# Altium schematic sheet [10] - ESP32.SchDoc
size A4; DocumentNumber: 10; SheetNumber: 10; SheetTotal: 14
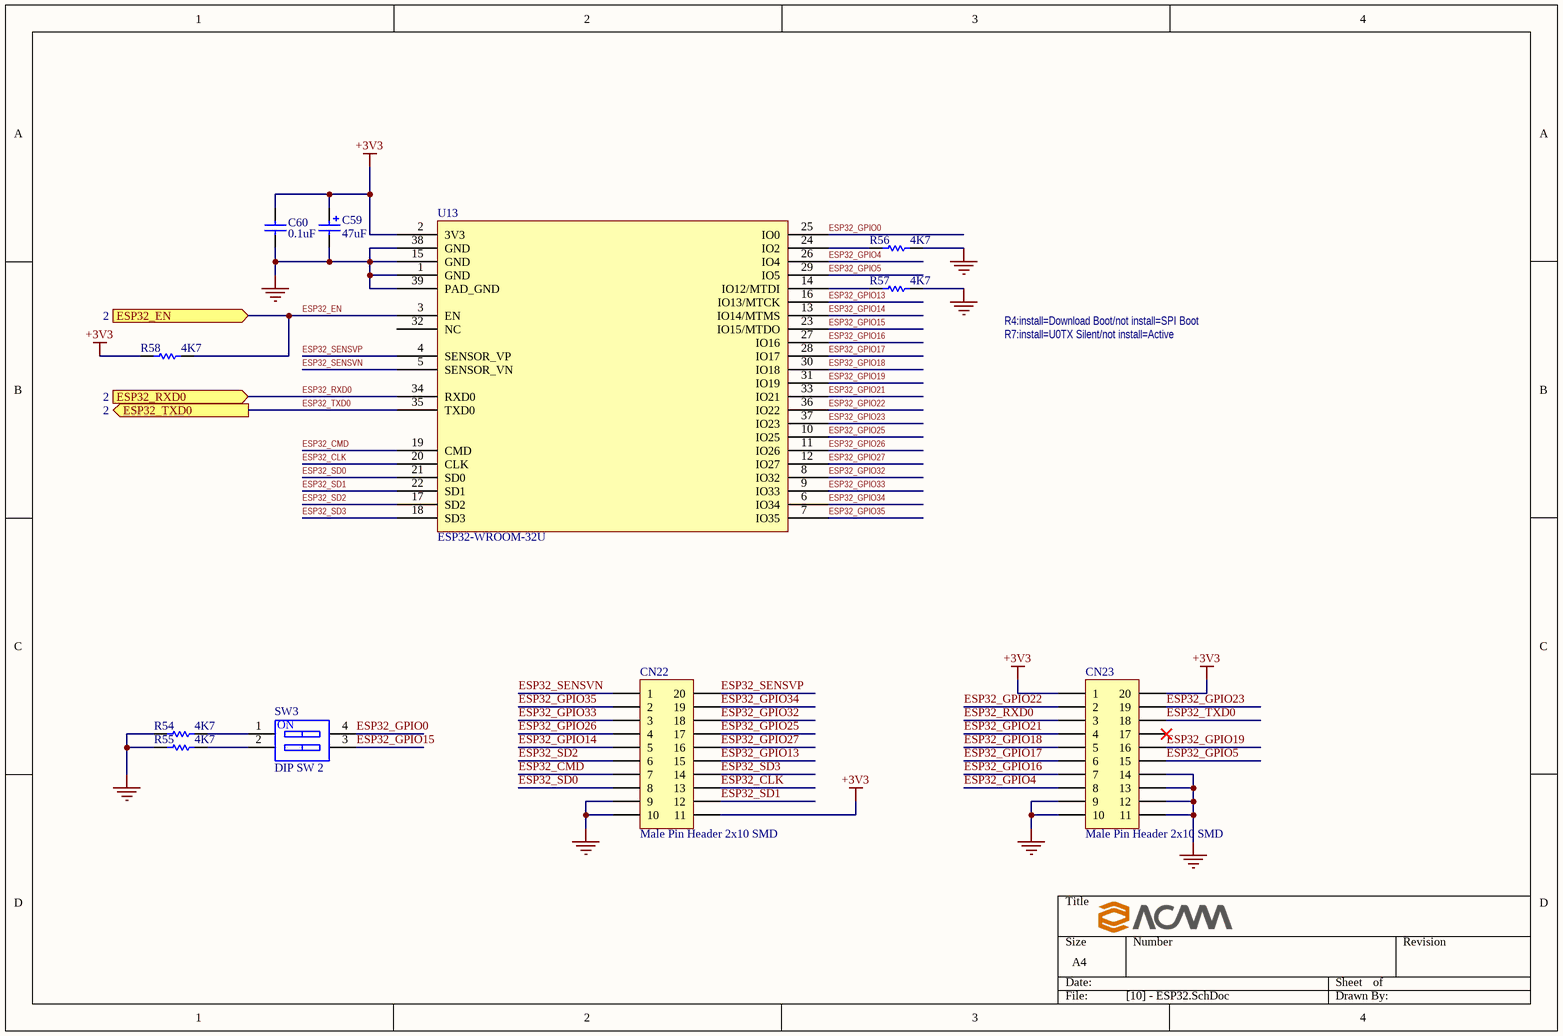
[diagram p0: [10] - ESP32.SchDoc]

## Parts
C59  47uF  [TANT_B]
C60  0.1uF  [0402_C]
CN22  Male Pin Header 2x10 SMD  [HEADER_SMD_2x10]
CN23  Male Pin Header 2x10 SMD  [HEADER_SMD_2x10]
R54  4K7  [0402_R]
R55  4K7  [0402_R]
R56  4K7  [0402_R]
R57  4K7  [0402_R]
R58  4K7  [0402_R]
SW3  DIP SW 2  [DIP-SW-2-Piano]
U13  ESP32-WROOM-32U  [ESP32S_W]

## Ports
ESP32_EN (in, see 2), ESP32_RXD0 (in, see 2), ESP32_TXD0 (out, see 2)

## Nets
+3V3: C59.1 C60.1 CN22.11 CN23.1 CN23.20 R58.1 U13.2(3V3)
GND: C59.2 C60.2 CN22.9 CN22.10 CN23.9 CN23.10 CN23.11 CN23.12 CN23.13 CN23.14 R54.1 R55.1 R56.2 R57.2 U13.1(GND) U13.15(GND) U13.38(GND) U13.39(PAD_GND)
ESP32_CLK: CN22.13 U13.20(CLK)
ESP32_CMD: CN22.7 U13.19(CMD)
ESP32_EN: R58.2 U13.3(EN) ; port ESP32_EN
ESP32_GPIO0: SW3.4(A4) U13.25(IO0)
ESP32_GPIO4: CN23.8 U13.26(IO4)
ESP32_GPIO5: CN23.15 U13.29(IO5)
ESP32_GPIO13: CN22.15 U13.16(IO13/MTCK)
ESP32_GPIO14: CN22.5 U13.13(IO14/MTMS)
ESP32_GPIO15: SW3.3(A3) U13.23(IO15/MTDO)
ESP32_GPIO16: CN23.7 U13.27(IO16)
ESP32_GPIO17: CN23.6 U13.28(IO17)
ESP32_GPIO18: CN23.5 U13.30(IO18)
ESP32_GPIO19: CN23.16 U13.31(IO19)
ESP32_GPIO21: CN23.4 U13.33(IO21)
ESP32_GPIO22: CN23.2 U13.36(IO22)
ESP32_GPIO23: CN23.19 U13.37(IO23)
ESP32_GPIO25: CN22.17 U13.10(IO25)
ESP32_GPIO26: CN22.4 U13.11(IO26)
ESP32_GPIO27: CN22.16 U13.12(IO27)
ESP32_GPIO32: CN22.18 U13.8(IO32)
ESP32_GPIO33: CN22.3 U13.9(IO33)
ESP32_GPIO34: CN22.19 U13.6(IO34)
ESP32_GPIO35: CN22.2 U13.7(IO35)
ESP32_RXD0: CN23.3 U13.34(RXD0) ; port ESP32_RXD0
ESP32_SD0: CN22.8 U13.21(SD0)
ESP32_SD1: CN22.12 U13.22(SD1)
ESP32_SD2: CN22.6 U13.17(SD2)
ESP32_SD3: CN22.14 U13.18(SD3)
ESP32_SENSVN: CN22.1 U13.5(SENSOR_VN)
ESP32_SENSVP: CN22.20 U13.4(SENSOR_VP)
ESP32_TXD0: CN23.18 U13.35(TXD0) ; port ESP32_TXD0
NetR54_2: R54.2 SW3.1(A1)
NetR55_2: R55.2 SW3.2(A2)
NetR56_1: R56.1 U13.24(IO2)
NetR57_1: R57.1 U13.14(IO12/MTDI)

Not connected (* = marked no-connect by the designer): CN23 17*; U13 32(NC)

## Notes on the sheet
- R7:install=U0TX Silent/not install=Active
- R4:install=Download Boot/not install=SPI Boot
- (in symbol DIP SW-2) ON

## Library data of the parts
C59 = Cap Tant: Tantalum Polarized Capacitor; RATED_VOLTAGE: 6.3V; Value: 47uF
C60 = Cap SMD: Non-Pol SMD Capacitor; RATED_VOLTAGE: 16V; Value: 0.1uF; Manufacturer Part Num: *
CN22 CN23 = Pin header Male 2x10 smd: SMD Male Pin Header 2.54mm Pitch, 2x10; Value: Male Pin Header 2x10 SMD
R54-R58 = Res SMD: SMD Resistor; Tolerance: 1%; Value: 4K7; Manufacturer Part Num: *
SW3 = DIP SW-2: DIP Switch, 2 Position, SPST; Manufacturer Part Num: BPA02B; Value: DIP SW 2
U13 = ESP32-WROOM-32U: powerful, generic Wi-Fi+BT+BLE MCU module; Value: ESP32-WROOM-32U